# Altium schematic sheet DAC.SchDoc
size A4
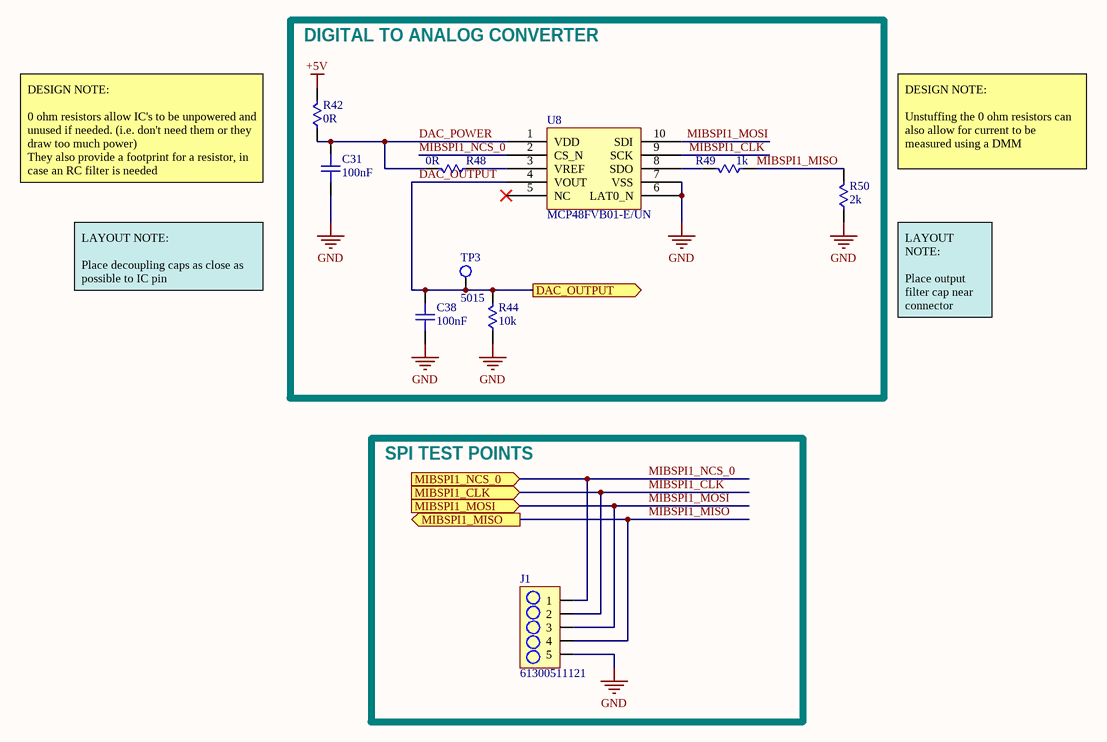
[diagram p0: DAC.SchDoc]

## Parts
C31  100nF  [C0402]
C38  100nF  [C0402]
J1  61300511121  [5PIN_HEADER]
R42  0R  [R0402]
R44  10k  [R0402]
R48  0R  [R0402]
R49  1k  [R0402]
R50  2k  [R0402]
TP3  5015  [TP_HOOK]
U8  MCP48FVB01-E/UN  [MSSOP-10]

## Blocks framed on the sheet
DIGITAL TO ANALOG CONVERTER: C31 C38 R42 R44 R48-R50 TP3 U8
SPI TEST POINTS: J1

## Ports
DAC_OUTPUT, MIBSPI1_CLK, MIBSPI1_MISO, MIBSPI1_MOSI, MIBSPI1_NCS_0

## Nets
+5V: R42.2
GND: C31.1 C38.1 J1.5 R44.1 R50.1 U8.6(LAT0_N) U8.7(VSS)
DAC_OUTPUT: C38.2 R44.2 TP3.1 U8.4(VOUT) ; port DAC_OUTPUT
DAC_POWER: C31.2 R42.1 R48.2 U8.1(VDD)
MIBSPI1_CLK: J1.2 U8.9(SCK) ; port MIBSPI1_CLK
MIBSPI1_MISO: J1.4 R49.1 R50.2 ; port MIBSPI1_MISO
MIBSPI1_MOSI: J1.3 U8.10(SDI) ; port MIBSPI1_MOSI
MIBSPI1_NCS_0: J1.1 U8.2(CS_N) ; port MIBSPI1_NCS_0
NetR48_1: R48.1 U8.3(VREF)
NetR49_2: R49.2 U8.8(SDO)

Not connected (* = marked no-connect by the designer): U8 5(NC)*

## Notes on the sheet
- DESIGN NOTE:
  0 ohm resistors allow IC's to be unpowered and unused if needed. (i.e. don't need them or they draw too much power)
  They also provide a footprint for a resistor, in case an RC filter is needed
- DESIGN NOTE:
  Unstuffing the 0 ohm resistors can also allow for current to be measured using a DMM
- LAYOUT NOTE:
  Place decoupling caps as close as possible to IC pin
- LAYOUT NOTE:
  Place output filter cap near connector

## Library data of the parts
C31 C38 = CL05A104MP5NNNC: CAP MLCC 0.1uF 10V X5R 0402 20% SMD 0402 85C Paper T/R; Manufacturer: Samsung; Supplier 1: Digi-Key; Manufacturer Part Number: CL05A104MP5NNNC; Stock 1: 100000; Pricing 1: 1=0.1, 10=0.024, 100=0.0106, 500=0.0076, 1000=0.006, 2500=0.0054, 5000=0.005 (USD); Mount: Surface Mount; Case/Package: 0402; Case Code (Metric): 1005; Case Code (Imperial): 0402; Min Operating Temperature: -55°C; Max Operating Temperature: 85°C; Packaging: Tape and Reel; Capacitance: 100nF; Tolerance: 20%; Voltage Rating: 10V; Dielectric: X5R; Voltage Rating (DC): 10V; Length: 1mm; Height: 0.5mm; Width: 0.02inch; Thickness: 0.022inch; Depth: 0.5mm; Radiation Hardening: No; Lead Free: Lead Free; ComponentLink1URL: https://media.digikey.com/pdf/Data%20Sheets/Samsung%20PDFs/CL_Series_MLCC_ds.pdf; ComponentLink1Description: https://media.digikey.com/pdf/Data%20Sheets/Samsung%20PDFs/CL_Series_MLCC_ds.pdf; Supplier Part Number 1: 1276-1443-1-ND
J1 = 61300511121: CONN_HeaderPins5pos WURTH ELEKTRONIK         61300511121            Board-To-Board Connector, Vertical, WR-PHD Series, Through Hole, Header, 5 Contacts, 2.54 mm; Manufacturer: Wurth Electronics; Number of Positions: 5; Gender: Male; Connector Type: Male Pin; Pitch: 0.1inch; Supplier 1: Digi-Key; Manufacturer Part Number: 61300511121; Stock 1: 20896; Pricing 1: 1=0.25, 10=0.209, 25=0.174, 50=0.145, 100=0.132, 1000=0.12 (USD); Mount: Through Hole; Contact Plating: Gold; Contact Material: Copper; Color: Black; Number of Rows: 1; Packaging: Bulk; Termination: Solder; Number of Contacts: 5; Contact Mating Length: 0.236inch; REACH SVHC: Unknown; Lead Free: Lead Free; Supplier Part Number 1: 732-5318-ND
R42 R48 = RC0402JR-070RL: RES SMD 0 OHM 1/16W 0402; Manufacturer: Yageo; Resistance: 0mR; Power Rating: 62.5mW; Tolerance: 5%; Voltage Rating: 50V; Max Power Dissipation: 63mW; Temperature Coefficient: 200ppm/°C; Supplier 1: Digi-Key; Manufacturer Part Number: RC0402JR-070RL; Stock 1: 44333412; Pricing 1: 1=0.1, 10=0.017, 25=0.0124, 50=0.0096, 100=0.007, 250=0.0054, 500=0.0043, 1000=0.0032, 5000=0.0023 (USD); Case/Package: 0402; Contact Plating: Matte,Tin; Case Code (Metric): 1005; Case Code (Imperial): 0402; Min Operating Temperature: -55°C; Max Operating Temperature: 155°C; Packaging: Tape and Reel; Composition: Thick Film; Package Quantity: 1; Number of Terminations: 2; Termination: SMD/SMT; Military Standard: Not; Features: Moisture Resistant; Length: 1mm; Height: 0.016inch; Width: 0.02inch; Depth: 0.5mm; Radiation Hardening: No; REACH SVHC: Unknown; Lead Free: Lead Free; Supplier Part Number 1: 311-0.0JRCT-ND
R44 = RC0402JR-0710KL: RES SMD 10K OHM 5% 1/16W 0402; Manufacturer: Yageo; Resistance: 10kR; Power Rating: 62.5mW; Voltage Rating: 50V; Temperature Coefficient: 100ppm/°C; Max Power Dissipation: 63mW; Supplier 1: Digi-Key; Manufacturer Part Number: RC0402JR-0710KL; Stock 1: 47303622; Pricing 1: 1=0.1, 10=0.018, 100=0.0073, 1000=0.0033, 2500=0.0029, 5000=0.0024 (USD); Case/Package: 0402; Case Code (Metric): 1005; Case Code (Imperial): 0402; Min Operating Temperature: -55°C; Max Operating Temperature: 155°C; Packaging: Tape and Reel; Tolerance: 5%; Package Quantity: 1; Composition: Thick Film; Number of Terminations: 2; Termination: SMD/SMT; Military Standard: Not; Features: Moisture Resistant; Length: 1mm; Height: 0.016inch; Width: 0.02inch; Depth: 0.5mm; REACH SVHC: Unknown; Lead Free: Lead Free; Supplier Part Number 1: 311-10KJRCT-ND
R49 = RR0510P-102-D: RES SMD 1K OHM 0.5% 1/16W 0402; Manufacturer: Susumu; Resistance: 1kR; Power Rating: 63mW; Voltage Rating: 25V; Temperature Coefficient: 25ppm/°C; Supplier 1: Digi-Key; Manufacturer Part Number: RR0510P-102-D; Stock 1: 721157; Pricing 1: 1=0.1, 10=0.074, 100=0.0285, 1000=0.0125, 2500=0.0108, 5000=0.0097 (USD); Case/Package: 0402; Number of Pins: 2; Case Code (Metric): 1005; Case Code (Imperial): 0402; Min Operating Temperature: -55°C; Max Operating Temperature: 125°C; Package Quantity: 1; Tolerance: 0.5%; Packaging: Tape and Reel; Composition: Thin Film; Number of Terminations: 2; Termination: SMD/SMT; Max Power Dissipation: 63mW; Voltage Rating (DC): 25V; Length: 0.039inch; Height: 0.016inch; Width: 0.02inch; REACH SVHC: Unknown; Lead Free: Lead Free; ComponentLink1URL: http://www.susumu.co.jp/common/pdf/n_catalog_partition05_en.pdf; ComponentLink1Description: http://www.susumu.co.jp/common/pdf/n_catalog_partition05_en.pdf; ComponentLink2URL: http://www.farnell.com/datasheets/1581132.pdf; ComponentLink2Description: http://www.farnell.com/datasheets/1581132.pdf; Supplier Part Number 1: RR05P1.0KDCT-ND
R50 = RC0402FR-072KL: RES SMD 2K OHM 1% 1/16W 0402; Manufacturer: Yageo; Resistance: 2kR; Power Rating: 63mW; Voltage Rating: 50V; Temperature Coefficient: 100ppm/°C; Supplier 1: Digi-Key; Manufacturer Part Number: RC0402FR-072KL; Stock 1: 12787794; Pricing 1: 1=0.1, 10=0.016, 100=0.0067, 1000=0.003, 2500=0.0026, 5000=0.0022 (USD); Case/Package: 0402; Case Code (Metric): 1005; Case Code (Imperial): 0402; Min Operating Temperature: -55°C; Max Operating Temperature: 155°C; Tolerance: 1%; Package Quantity: 1; Packaging: Tape and Reel; Composition: Thick Film; Number of Terminations: 2; Termination: SMD/SMT; Military Standard: Not; Max Power Dissipation: 63mW; Voltage Rating (DC): 50V; Working Voltage: 50V; Features: Moisture Resistant; Length: 1mm; Height: 0.016inch; Width: 0.02inch; Depth: 0.5mm; REACH SVHC: Unknown; Lead Free: Lead Free; ComponentLink1URL: http://www.yageo.com/documents/recent/PYu-RC_Group_51_RoHS_L_10.pdf?src-supplier=Digi-Key; ComponentLink1Description: http://www.yageo.com/documents/recent/PYu-RC_Group_51_RoHS_L_10.pdf?src-supplier=Digi-Key; ComponentLink2URL: http://documents.rs-components.com/techlib://itc_doclist_GB.htm?stockno=6186510&src-supplier=RSComponents; ComponentLink2Description: http://documents.rs-components.com/techlib://itc_doclist_GB.htm?stockno=6186510&src-supplier=RSComponents; ComponentLink3URL: https://www.verical.com/server-webapp/html/getDatasheet?partID=358921&src-supplier=Verical; ComponentLink3Description: https://www.verical.com/server-webapp/html/getDatasheet?partID=358921&src-supplier=Verical; ComponentLink4URL: http://www.mouser.com/ds/2/447/PYu-RC0402_51_RoHS_L_6_r-8721.pdf?src-supplier=Mouser; ComponentLink4Description: http://www.mouser.com/ds/2/447/PYu-RC0402_51_RoHS_L_6_r-8721.pdf?src-supplier=Mouser; ComponentLink5URL: http://www.farnell.com/datasheets/1018594.pdf?src-supplier=Element14; ComponentLink5Description: http://www.farnell.com/datasheets/1018594.pdf?src-supplier=Element14; ComponentLink6URL: http://www.farnell.com/datasheets/2167052.pdf?src-supplier=Element14; ComponentLink6Description: http://www.farnell.com/datasheets/2167052.pdf?src-supplier=Element14; Supplier Part Number 1: 311-2KLRCT-ND
TP3 = 5015: TEST POINT, PCB, SMT; Manufacturer: Keystone Electronics; Number of Ports: 1; Supplier 1: Digi-Key; Manufacturer Part Number: 5015; Stock 1: 1937775; Pricing 1: 1=0.44, 10=0.421, 25=0.3604, 50=0.3064, 100=0.2944, 250=0.2644, 500=0.2524 (USD); Mount: Surface Mount; Colour: White; Contact Material: Bronze; Contact Plating: Tin,Silver,Lead; Material: Bronze,Silver; Package Quantity: 1; Packaging: Tape and Reel; Termination: Solder; Orientation: Straight; Length: 2.66mm; Height: 0.06inch; Thickness: 0.01inch; Depth: 1.01mm; REACH SVHC: No SVHC; Lead Free: Lead Free; ComponentLink1URL: https://datasheet.ciiva.com/2917/5015-2917616.pdf; ComponentLink1Description: https://datasheet.ciiva.com/2917/5015-2917616.pdf; ComponentLink2URL: https://datasheet.ciiva.com/2917/5015-2917617.pdf; ComponentLink2Description: https://datasheet.ciiva.com/2917/5015-2917617.pdf; ComponentLink3URL: https://datasheet.ciiva.com/1123/5015-1123862.pdf; ComponentLink3Description: https://datasheet.ciiva.com/1123/5015-1123862.pdf; ComponentLink4URL: https://datasheet.ciiva.com/16883/70182998-16883734.pdf; ComponentLink4Description: https://datasheet.ciiva.com/16883/70182998-16883734.pdf; Supplier Part Number 1: 36-5015CT-ND
U8 = MCP48FVB01-E/UN: IC DAC 8BIT V-OUT BUFF 10-MSOP; Manufacturer: Microchip; Number of Bits: 8; Number of D/A Converters: 1; Settling Time: 7.8us; Differential Output: No; Interface: SPI; Resolution: 8b; Supplier 1: Digi-Key; Manufacturer Part Number: MCP48FVB01-E/UN; Stock 1: 213; Pricing 1: 1=0.7, 25=0.5872, 100=0.5356 (USD); Case/Package: MSOP; Number of Pins: 10; Min Operating Temperature: -40°C; Max Operating Temperature: 125°C; Packaging: Rail/Tube; REACH SVHC: No SVHC; Supplier Part Number 1: MCP48FVB01-E/UN-ND